# Altium project PCB_Project_Autolabor.PrjPcb
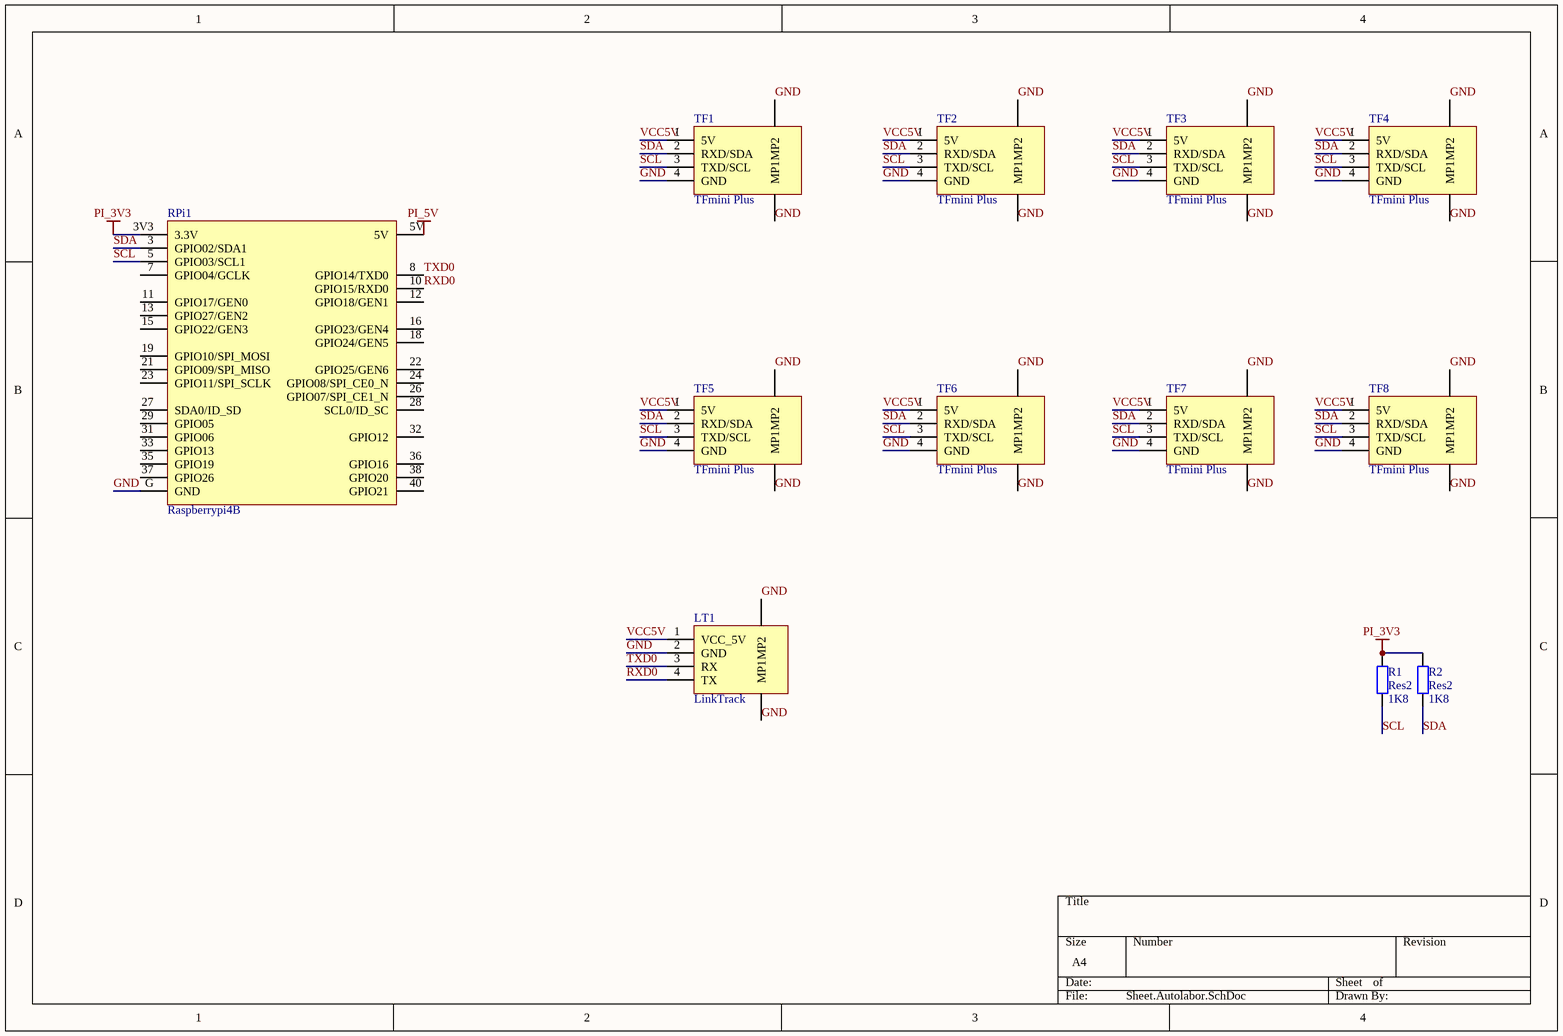
[diagram p0: Sheet.Autolabor.SchDoc]
2 sheets, 35 parts. Net scope: global (net labels, ports and power ports of the same name join across sheets).
Board file: PCB.Autolabor.PcbDoc
Sheets:
  Sheet.Autolabor.SchDoc
  Sheet.Autolabor.Power.SchDoc

## Sheet Sheet.Autolabor.SchDoc
size A4

### Parts
LT1  LinkTrack  [GH1.25-S-4P-small]
R1  Res2  value 1K8  [6-0805_L]
R2  Res2  value 1K8  [6-0805_L]
RPi1  Raspberrypi4B  [RPi-40p-small]
TF1  TFmini Plus  [GH1.25-S-4P-small]
TF2  TFmini Plus  [GH1.25-S-4P-small]
TF3  TFmini Plus  [GH1.25-S-4P-small]
TF4  TFmini Plus  [GH1.25-S-4P-small]
TF5  TFmini Plus  [GH1.25-S-4P-small]
TF6  TFmini Plus  [GH1.25-S-4P-small]
TF7  TFmini Plus  [GH1.25-S-4P-small]
TF8  TFmini Plus  [GH1.25-S-4P-small]

### Nets
GND: LT1.2(GND) LT1.MP1 LT1.MP2 RPi1.G(GND) TF1.4(GND) TF1.MP1 TF1.MP2 TF2.4(GND) TF2.MP1 TF2.MP2 TF3.4(GND) TF3.MP1 TF3.MP2 TF4.4(GND) TF4.MP1 TF4.MP2 TF5.4(GND) TF5.MP1 TF5.MP2 TF6.4(GND) TF6.MP1 TF6.MP2 TF7.4(GND) TF7.MP1 TF7.MP2 TF8.4(GND) TF8.MP1 TF8.MP2
PI_3V3: R1.2 R2.2 RPi1.3V3(3.3V)
PI_5V: RPi1.5V
VCC5V: LT1.1(VCC_5V) TF1.1(5V) TF2.1(5V) TF3.1(5V) TF4.1(5V) TF5.1(5V) TF6.1(5V) TF7.1(5V) TF8.1(5V)
RXD0: LT1.4(TX) RPi1.10(GPIO15/RXD0)
SCL: R1.1 RPi1.5(GPIO03/SCL1) TF1.3(TXD/SCL) TF2.3(TXD/SCL) TF3.3(TXD/SCL) TF4.3(TXD/SCL) TF5.3(TXD/SCL) TF6.3(TXD/SCL) TF7.3(TXD/SCL) TF8.3(TXD/SCL)
SDA: R2.1 RPi1.3(GPIO02/SDA1) TF1.2(RXD/SDA) TF2.2(RXD/SDA) TF3.2(RXD/SDA) TF4.2(RXD/SDA) TF5.2(RXD/SDA) TF6.2(RXD/SDA) TF7.2(RXD/SDA) TF8.2(RXD/SDA)
TXD0: LT1.3(RX) RPi1.8(GPIO14/TXD0)

Not connected (* = marked no-connect by the designer): RPi1 7(GPIO04/GCLK) 11(GPIO17/GEN0) 12(GPIO18/GEN1) 13(GPIO27/GEN2) 15(GPIO22/GEN3) 16(GPIO23/GEN4) 18(GPIO24/GEN5) 19(GPIO10/SPI_MOSI) 21(GPIO09/SPI_MISO) 22(GPIO25/GEN6) 23(GPIO11/SPI_SCLK) 24(GPIO08/SPI_CE0_N) 26(GPIO07/SPI_CE1_N) 27(SDA0/ID_SD) 28(SCL0/ID_SC) 29(GPIO05) 31(GPIO06) 32(GPIO12) 33(GPIO13) 35(GPIO19) 36(GPIO16) 37(GPIO26) 38(GPIO20) 40(GPIO21)

### Library data of the parts
R1 R2 = Res2: Resistor; Published: 8-Jun-2000; LatestRevisionDate: 17-Jul-2002; LatestRevisionNote: Re-released for DXP Platform.; PackageReference: AXIAL-0.4; Publisher: Altium Limited; PackageDescription: Axial Device, Thru-Hole; 2 Leads; 0.4 in Pin Spacing
RPi1 = Raspberrypi4B_EX
TF1-TF8 = TF

## Sheet Sheet.Autolabor.Power.SchDoc
size A4
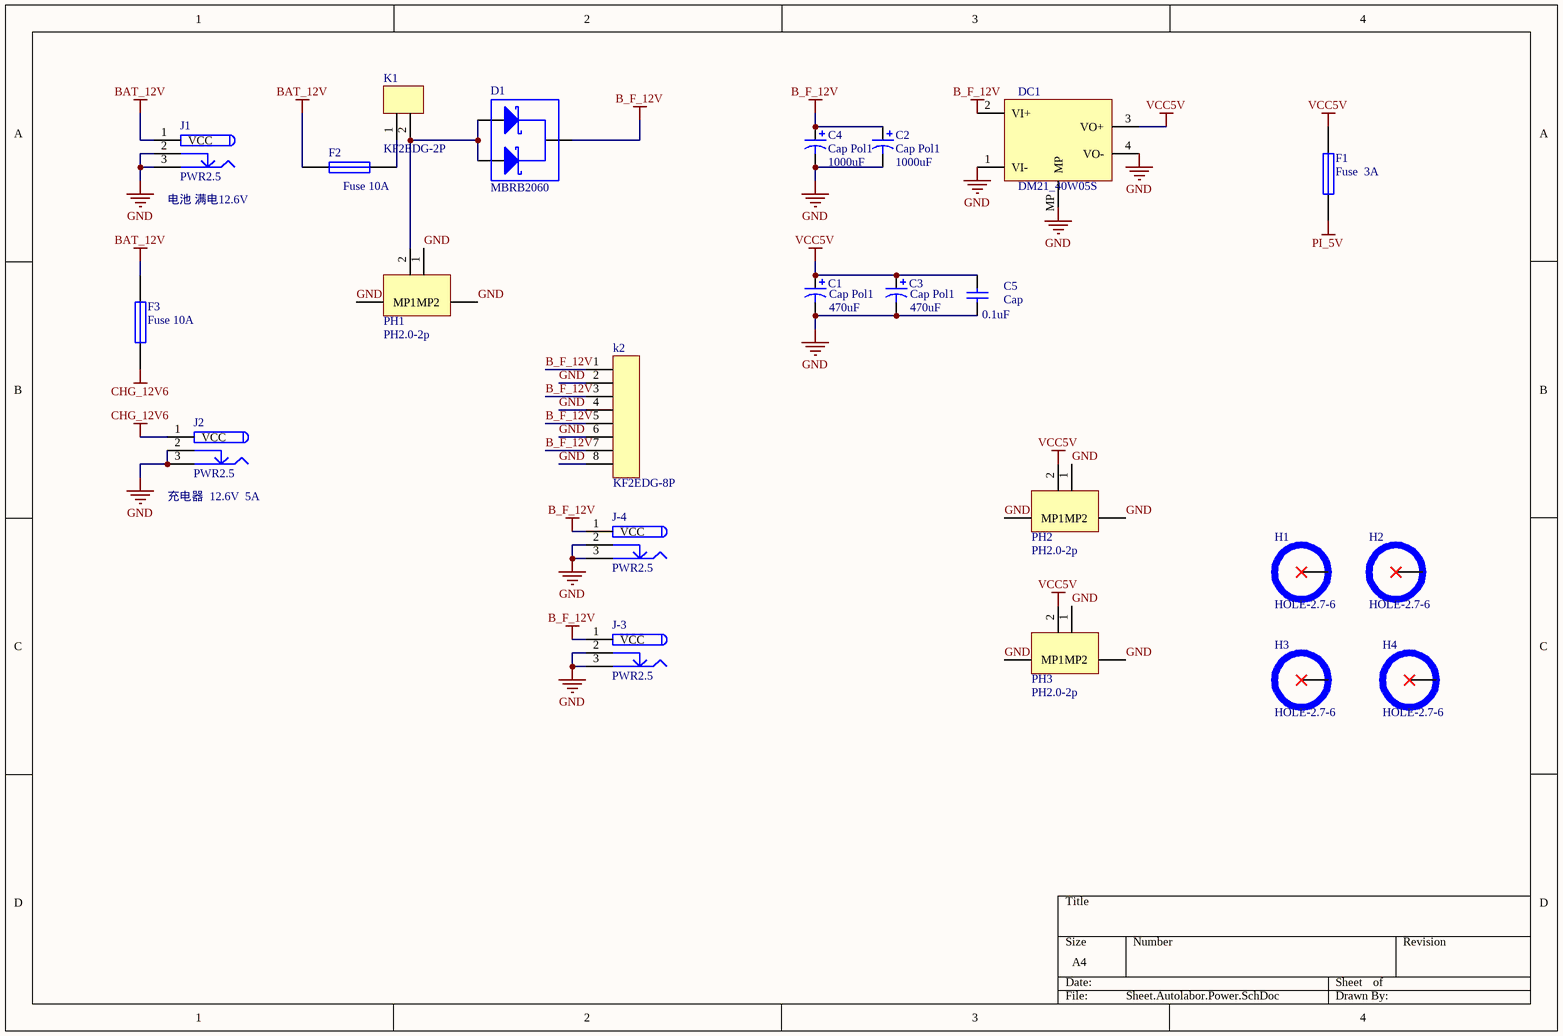
[diagram p1: Sheet.Autolabor.Power.SchDoc]

### Parts
C1  Cap Pol1  value 470uF  [CAPAE8883X102M]
C2  Cap Pol1  value 1000uF  [CAPAE108103X102M]
C3  Cap Pol1  value 470uF  [CAPAE8883X102M]
C4  Cap Pol1  value 1000uF  [CAPAE108103X102M]
C5  Cap  value 0.1uF  [6-0805_L]
D1  MBRB2060  [D2PAK_M]
DC1  DM21_40W05S  [DM21_40W05S-HOLE]
F1  Fuse  3A  [C1206]
F2  Fuse 10A  [C1206]
F3  Fuse 10A  [C1206]
H1  HOLE-2.7-6  [HOLE-2.7-6]
H2  HOLE-2.7-6  [HOLE-2.7-6]
H3  HOLE-2.7-6  [HOLE-2.7-6]
H4  HOLE-2.7-6  [HOLE-2.7-6]
J1  PWR2.5  [KLD-0202-SLOT]
J2  PWR2.5  [KLD-0202-SLOT]
J-3  PWR2.5  [KLD-0202-SLOT]
J-4  PWR2.5  [KLD-0202-SLOT]
K1  KF2EDG-2P  [KF2EDG-3.81-2P]
k2  KF2EDG-8P  [KF2EDG-3.81-8P]
PH1  PH2.0-2p  [PH2.0-LIE-2P]
PH2  PH2.0-2p  [PH2.0-LIE-2P]
PH3  PH2.0-2p  [PH2.0-LIE-2P]

### Nets
B_F_12V: C2.1 C4.1 D1.2(K) DC1.2(VI+) J-3.1(VCC) J-4.1(VCC) k2.1 k2.3 k2.5 k2.7
BAT_12V: F2.1 F3.2 J1.1(VCC)
CHG_12V6: F3.1 J2.1(VCC)
GND: C1.2 C2.2 C3.2 C4.2 C5.1 DC1.1(VI-) DC1.4(VO-) DC1.MP J1.2 J1.3 J2.2 J2.3 J-3.2 J-3.3 J-4.2 J-4.3 k2.2 k2.4 k2.6 k2.8 PH1.1 PH1.MP1 PH1.MP2 PH2.1 PH2.MP1 PH2.MP2 PH3.1 PH3.MP1 PH3.MP2
PI_5V: F1.1
VCC5V: C1.1 C3.1 C5.2 DC1.3(VO+) F1.2 PH2.2 PH3.2
NetD1_1: D1.1(A) D1.3(A) K1.2 PH1.2
NetF2_2: F2.2 K1.1

Not connected (* = marked no-connect by the designer): H1 1*; H2 1*; H3 1*; H4 1*

### Notes on the sheet
- (near J1) 电池 满电12.6V
- (near J2) 充电器  12.6V  5A

### Library data of the parts
C1-C4 = Cap Pol1: Polarized Capacitor (Radial); Published: 8-Jun-2000; LatestRevisionDate: 17-Jul-2002; LatestRevisionNote: Re-released for DXP Platform.; PackageReference: RB7.6-15; Publisher: Altium Limited; PackageDescription: Polarized Capacitor (Radial); 2 Leads
C5 = Cap: Capacitor; Published: 8-Jun-2000; LatestRevisionDate: 17-Jul-2002; LatestRevisionNote: Re-released for DXP Platform.; PackageReference: RAD-0.3; Publisher: Altium Limited; PackageDescription: Radial Cap, Thru-Hole; 2 Leads; 0.3 in Pin Spacing
D1 = Schottky-MBRB: Schottky Diode; Published: 8-Jun-2000; LatestRevisionDate: 17-Jul-2002; LatestRevisionNote: Re-released for DXP Platform.; PackageReference: SMB; Publisher: Altium Limited; PackageDescription: DO-214-AA/SMB; 2 C-Bend Leads; Body 5.3 x 3.6 mm, inc. leads (LxW); Code_JEDEC: DO-214-AA
F1-F3 = Fuse 1: Fuse; Published: 8-Jun-2000; LatestRevisionDate: 17-Jul-2002; LatestRevisionNote: Re-released for DXP Platform.; PackageReference: PIN-W2/E2.8; Publisher: Altium Limited; PackageDescription: Thru-Hole; 2 Leads
J1 J2 J-3 J-4 = PWR2.5: Low Voltage Power Supply Connector; Published: 17-Dec-2003; DatasheetDocument: 09-May-2002; Publisher: Altium Limited; ComponentLink1Description: Manufacturer Link; ComponentLink1URL: http://domino.kycon.com/internet/Products.html

## Nets that join several sheets
GND: Sheet.Autolabor (28 pins), Sheet.Autolabor.Power (29 pins)
PI_5V: Sheet.Autolabor (RPi1.5V), Sheet.Autolabor.Power (F1.1)
VCC5V: Sheet.Autolabor (9 pins), Sheet.Autolabor.Power (7 pins)